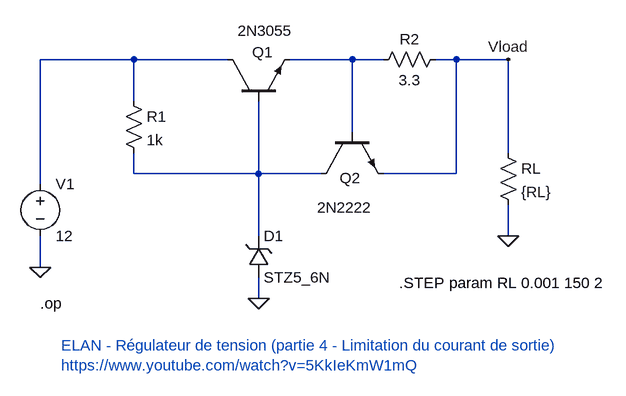
[diagram p0: schematic CurrentLimiter-04.asc]
CurrentLimiter-04.asc, the LTspice schematic file:
Version 4.1
SHEET 1 884 680
WIRE 144 -32 0 -32
WIRE 288 -32 144 -32
WIRE 480 -32 384 -32
WIRE 528 -32 480 -32
WIRE 640 -32 608 -32
WIRE 720 -32 640 -32
WIRE 144 32 144 -32
WIRE 480 80 480 -32
WIRE 720 112 720 -32
WIRE 144 144 144 112
WIRE 336 144 336 32
WIRE 336 144 144 144
WIRE 432 144 336 144
WIRE 640 144 640 -32
WIRE 640 144 528 144
WIRE 0 160 0 -32
WIRE 336 240 336 144
WIRE 720 240 720 192
WIRE 0 288 0 240
WIRE 336 336 336 304
FLAG 0 288 0
FLAG 336 336 0
FLAG 720 240 0
FLAG 720 -32 Vload
SYMBOL voltage 0 144 R0
WINDOW 123 0 0 Left 0
WINDOW 39 0 0 Left 0
SYMATTR InstName V1
SYMATTR Value 12
SYMBOL npn 288 32 R270
WINDOW 0 75 38 VRight 2
WINDOW 3 108 16 VRight 2
SYMATTR InstName Q1
SYMATTR Value 2N3055
SYMBOL zener 320 304 M180
WINDOW 0 24 64 Left 2
WINDOW 3 24 0 Left 2
SYMATTR InstName D1
SYMATTR Value STZ5_6N
SYMBOL res 128 16 R0
SYMATTR InstName R1
SYMATTR Value 1k
SYMBOL res 512 -16 R270
WINDOW 0 32 56 VTop 2
WINDOW 3 0 56 VBottom 2
SYMATTR InstName R2
SYMATTR Value 3.3
SYMBOL res 704 96 R0
SYMATTR InstName RL
SYMATTR Value {RL}
SYMBOL npn 432 80 M90
WINDOW 0 71 29 VRight 2
WINDOW 3 116 -6 VRight 2
SYMATTR InstName Q2
SYMATTR Value 2N2222
TEXT 32 408 Left 2 ;ELAN - Régulateur de tension (partie 4 - Limitation du courant de sortie)\nhttps://www.youtube.com/watch?v=5KkIeKmW1mQ
TEXT 0 344 Left 2 !.op
TEXT 552 312 Left 2 !.STEP param RL 0.001 150 2

The netlist it stands for:
* CurrentLimiter-04.asc
V1 N001 0 12
Q1 N001 N003 N002 0 2N3055
D1 0 N003 STZ5_6N
R1 N001 N003 1k
R2 N002 Vload 3.3
RL Vload 0 {RL}
Q2 N003 N002 Vload 0 2N2222
.model D D
.lib standard.dio
.model NPN NPN
.model PNP PNP
.lib standard.bjt
* ELAN - Régulateur de tension (partie 4 - Limitation du courant de sortie)
* https://www.youtube.com/watch?v=5KkIeKmW1mQ
.op
.STEP param RL 0.001 150 2
.backanno
.end